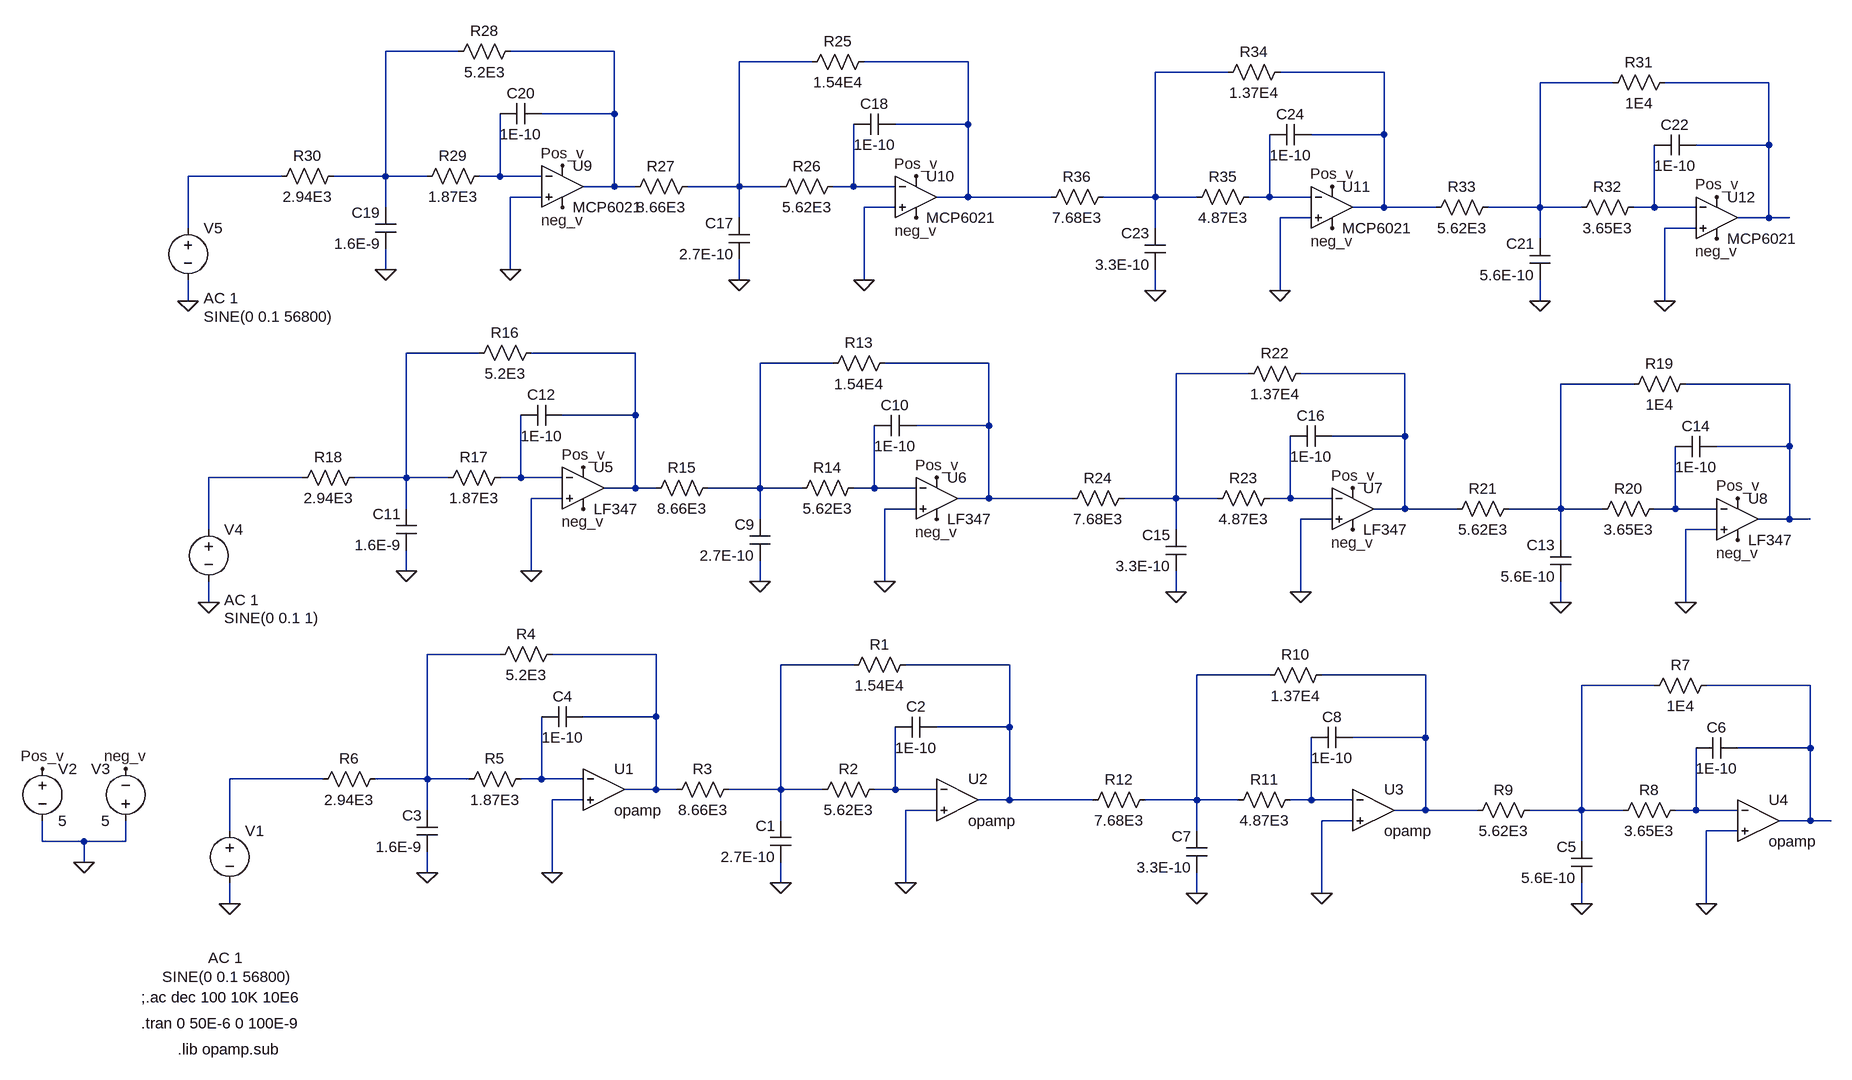
[diagram p0: schematic High order E96 non ideal components.asc]
High order E96 non ideal components.asc, the LTspice schematic file:
Version 4
SHEET 1 2240 680
WIRE 80 -1232 -32 -1232
WIRE 320 -1232 160 -1232
WIRE 624 -1216 512 -1216
WIRE 864 -1216 704 -1216
WIRE 1264 -1200 1152 -1200
WIRE 1504 -1200 1344 -1200
WIRE 1856 -1184 1744 -1184
WIRE 2096 -1184 1936 -1184
WIRE 320 -1136 320 -1232
WIRE 320 -1136 208 -1136
WIRE 864 -1120 864 -1216
WIRE 864 -1120 752 -1120
WIRE 1504 -1104 1504 -1200
WIRE 1504 -1104 1392 -1104
WIRE 2096 -1088 2096 -1184
WIRE 2096 -1088 1984 -1088
WIRE -192 -1040 -336 -1040
WIRE -32 -1040 -32 -1232
WIRE -32 -1040 -112 -1040
WIRE 32 -1040 -32 -1040
WIRE 144 -1040 144 -1136
WIRE 144 -1040 112 -1040
WIRE 208 -1040 144 -1040
WIRE 320 -1024 320 -1136
WIRE 320 -1024 272 -1024
WIRE 352 -1024 320 -1024
WIRE 512 -1024 512 -1216
WIRE 512 -1024 432 -1024
WIRE 576 -1024 512 -1024
WIRE 688 -1024 688 -1120
WIRE 688 -1024 656 -1024
WIRE 752 -1024 688 -1024
WIRE 208 -1008 160 -1008
WIRE 864 -1008 864 -1120
WIRE 864 -1008 816 -1008
WIRE 992 -1008 864 -1008
WIRE 1152 -1008 1152 -1200
WIRE 1152 -1008 1072 -1008
WIRE 1216 -1008 1152 -1008
WIRE 1328 -1008 1328 -1104
WIRE 1328 -1008 1296 -1008
WIRE 1392 -1008 1328 -1008
WIRE -32 -992 -32 -1040
WIRE 752 -992 704 -992
WIRE 1504 -992 1504 -1104
WIRE 1504 -992 1456 -992
WIRE 1584 -992 1504 -992
WIRE 1744 -992 1744 -1184
WIRE 1744 -992 1664 -992
WIRE 1808 -992 1744 -992
WIRE 1920 -992 1920 -1088
WIRE 1920 -992 1888 -992
WIRE 1984 -992 1920 -992
WIRE 512 -976 512 -1024
WIRE 1392 -976 1344 -976
WIRE 2096 -976 2096 -1088
WIRE 2096 -976 2048 -976
WIRE 2128 -976 2096 -976
WIRE -336 -960 -336 -1040
WIRE 1152 -960 1152 -1008
WIRE 1984 -960 1936 -960
WIRE 1744 -944 1744 -992
WIRE -32 -896 -32 -928
WIRE 160 -896 160 -1008
WIRE 512 -880 512 -912
WIRE 704 -880 704 -992
WIRE 1152 -864 1152 -896
WIRE 1344 -864 1344 -976
WIRE -336 -848 -336 -880
WIRE 1744 -848 1744 -880
WIRE 1936 -848 1936 -960
WIRE 112 -768 0 -768
WIRE 352 -768 192 -768
WIRE 656 -752 544 -752
WIRE 896 -752 736 -752
WIRE 1296 -736 1184 -736
WIRE 1536 -736 1376 -736
WIRE 1888 -720 1776 -720
WIRE 2128 -720 1968 -720
WIRE 352 -672 352 -768
WIRE 352 -672 240 -672
WIRE 896 -656 896 -752
WIRE 896 -656 784 -656
WIRE 1536 -640 1536 -736
WIRE 1536 -640 1424 -640
WIRE 2128 -624 2128 -720
WIRE 2128 -624 2016 -624
WIRE -160 -576 -304 -576
WIRE 0 -576 0 -768
WIRE 0 -576 -80 -576
WIRE 64 -576 0 -576
WIRE 176 -576 176 -672
WIRE 176 -576 144 -576
WIRE 240 -576 176 -576
WIRE 352 -560 352 -672
WIRE 352 -560 304 -560
WIRE 384 -560 352 -560
WIRE 544 -560 544 -752
WIRE 544 -560 464 -560
WIRE 608 -560 544 -560
WIRE 720 -560 720 -656
WIRE 720 -560 688 -560
WIRE 784 -560 720 -560
WIRE 240 -544 192 -544
WIRE 896 -544 896 -656
WIRE 896 -544 848 -544
WIRE 1024 -544 896 -544
WIRE 1184 -544 1184 -736
WIRE 1184 -544 1104 -544
WIRE 1248 -544 1184 -544
WIRE 1360 -544 1360 -640
WIRE 1360 -544 1328 -544
WIRE 1424 -544 1360 -544
WIRE 0 -528 0 -576
WIRE 784 -528 736 -528
WIRE 1536 -528 1536 -640
WIRE 1536 -528 1488 -528
WIRE 1616 -528 1536 -528
WIRE 1776 -528 1776 -720
WIRE 1776 -528 1696 -528
WIRE 1840 -528 1776 -528
WIRE 1952 -528 1952 -624
WIRE 1952 -528 1920 -528
WIRE 2016 -528 1952 -528
WIRE 544 -512 544 -560
WIRE 1424 -512 1376 -512
WIRE 2128 -512 2128 -624
WIRE 2128 -512 2080 -512
WIRE 2160 -512 2128 -512
WIRE -304 -496 -304 -576
WIRE 1184 -496 1184 -544
WIRE 2016 -496 1968 -496
WIRE 1776 -480 1776 -528
WIRE 0 -432 0 -464
WIRE 192 -432 192 -544
WIRE 544 -416 544 -448
WIRE 736 -416 736 -528
WIRE 1184 -400 1184 -432
WIRE 1376 -400 1376 -512
WIRE -304 -384 -304 -416
WIRE 1776 -384 1776 -416
WIRE 1968 -384 1968 -496
WIRE 144 -304 32 -304
WIRE 384 -304 224 -304
WIRE 688 -288 576 -288
WIRE 928 -288 768 -288
WIRE 1328 -272 1216 -272
WIRE 1568 -272 1408 -272
WIRE 1920 -256 1808 -256
WIRE 2160 -256 2000 -256
WIRE 384 -208 384 -304
WIRE 384 -208 272 -208
WIRE 928 -192 928 -288
WIRE 928 -192 816 -192
WIRE 1568 -176 1568 -272
WIRE 1568 -176 1456 -176
WIRE 2160 -160 2160 -256
WIRE 2160 -160 2048 -160
WIRE -128 -112 -272 -112
WIRE 32 -112 32 -304
WIRE 32 -112 -48 -112
WIRE 96 -112 32 -112
WIRE 208 -112 208 -208
WIRE 208 -112 176 -112
WIRE 272 -112 208 -112
WIRE 384 -96 384 -208
WIRE 384 -96 336 -96
WIRE 416 -96 384 -96
WIRE 576 -96 576 -288
WIRE 576 -96 496 -96
WIRE 640 -96 576 -96
WIRE 752 -96 752 -192
WIRE 752 -96 720 -96
WIRE 816 -96 752 -96
WIRE 272 -80 224 -80
WIRE 928 -80 928 -192
WIRE 928 -80 880 -80
WIRE 1056 -80 928 -80
WIRE 1216 -80 1216 -272
WIRE 1216 -80 1136 -80
WIRE 1280 -80 1216 -80
WIRE 1392 -80 1392 -176
WIRE 1392 -80 1360 -80
WIRE 1456 -80 1392 -80
WIRE 32 -64 32 -112
WIRE 816 -64 768 -64
WIRE 1568 -64 1568 -176
WIRE 1568 -64 1520 -64
WIRE 1648 -64 1568 -64
WIRE 1808 -64 1808 -256
WIRE 1808 -64 1728 -64
WIRE 1872 -64 1808 -64
WIRE 1984 -64 1984 -160
WIRE 1984 -64 1952 -64
WIRE 2048 -64 1984 -64
WIRE 576 -48 576 -96
WIRE 1456 -48 1408 -48
WIRE 2160 -48 2160 -160
WIRE 2160 -48 2112 -48
WIRE 2192 -48 2160 -48
WIRE -272 -32 -272 -112
WIRE 1216 -32 1216 -80
WIRE 2048 -32 2000 -32
WIRE -560 -16 -560 -48
WIRE -496 -16 -560 -16
WIRE -432 -16 -432 -48
WIRE -432 -16 -496 -16
WIRE 1808 -16 1808 -64
WIRE -496 16 -496 -16
WIRE 32 32 32 0
WIRE 224 32 224 -80
WIRE 576 48 576 16
WIRE 768 48 768 -64
WIRE 1216 64 1216 32
WIRE 1408 64 1408 -48
WIRE -272 80 -272 48
WIRE 1808 80 1808 48
WIRE 2000 80 2000 -32
FLAG 768 48 0
FLAG 576 48 0
FLAG -272 80 0
FLAG -560 -128 Pos_v
FLAG -432 -128 neg_v
FLAG -496 16 0
FLAG 224 32 0
FLAG 32 32 0
FLAG 2000 80 0
FLAG 1808 80 0
FLAG 1408 64 0
FLAG 1216 64 0
FLAG 736 -416 0
FLAG 544 -416 0
FLAG -304 -384 0
FLAG 816 -576 Pos_v
FLAG 816 -512 neg_v
FLAG 192 -432 0
FLAG 0 -432 0
FLAG 272 -592 Pos_v
FLAG 272 -528 neg_v
FLAG 1968 -384 0
FLAG 1776 -384 0
FLAG 2048 -544 Pos_v
FLAG 2048 -480 neg_v
FLAG 1376 -400 0
FLAG 1184 -400 0
FLAG 1456 -560 Pos_v
FLAG 1456 -496 neg_v
FLAG 704 -880 0
FLAG 512 -880 0
FLAG -336 -848 0
FLAG 784 -1040 Pos_v
FLAG 784 -976 neg_v
FLAG 160 -896 0
FLAG -32 -896 0
FLAG 240 -1056 Pos_v
FLAG 240 -992 neg_v
FLAG 1936 -848 0
FLAG 1744 -848 0
FLAG 2016 -1008 Pos_v
FLAG 2016 -944 neg_v
FLAG 1344 -864 0
FLAG 1152 -864 0
FLAG 1424 -1024 Pos_v
FLAG 1424 -960 neg_v
SYMBOL res 784 -304 R90
WINDOW 0 0 56 VBottom 2
WINDOW 3 32 56 VTop 2
SYMATTR InstName R1
SYMATTR Value 1.54E4
SYMBOL res 736 -112 R90
WINDOW 0 0 56 VBottom 2
WINDOW 3 32 56 VTop 2
SYMATTR InstName R2
SYMATTR Value 5.62E3
SYMBOL res 512 -112 R90
WINDOW 0 0 56 VBottom 2
WINDOW 3 32 56 VTop 2
SYMATTR InstName R3
SYMATTR Value 8.66E3
SYMBOL cap 592 16 R180
WINDOW 0 24 56 Left 2
WINDOW 3 24 8 Left 2
SYMATTR InstName C1
SYMATTR Value 2.7E-10
SYMBOL cap 752 -176 R270
WINDOW 0 32 32 VTop 2
WINDOW 3 0 32 VBottom 2
SYMATTR InstName C2
SYMATTR Value 1E-10
SYMBOL voltage -272 -48 R0
WINDOW 123 -33 211 Left 2
WINDOW 39 0 0 Left 0
WINDOW 3 -104 240 Left 2
SYMATTR Value2 AC 1
SYMATTR Value SINE(0 0.1 56800)
SYMATTR InstName V1
SYMBOL voltage -560 -144 R0
WINDOW 123 0 0 Left 0
WINDOW 39 0 0 Left 0
SYMATTR InstName V2
SYMATTR Value 5
SYMBOL voltage -432 -32 R180
WINDOW 0 24 96 Left 2
WINDOW 3 24 16 Left 2
SYMATTR InstName V3
SYMATTR Value 5
SYMBOL res 240 -320 R90
WINDOW 0 0 56 VBottom 2
WINDOW 3 32 56 VTop 2
SYMATTR InstName R4
SYMATTR Value 5.2E3
SYMBOL res 192 -128 R90
WINDOW 0 0 56 VBottom 2
WINDOW 3 32 56 VTop 2
SYMATTR InstName R5
SYMATTR Value 1.87E3
SYMBOL res -32 -128 R90
WINDOW 0 0 56 VBottom 2
WINDOW 3 32 56 VTop 2
SYMATTR InstName R6
SYMATTR Value 2.94E3
SYMBOL cap 48 0 R180
WINDOW 0 24 56 Left 2
WINDOW 3 24 8 Left 2
SYMATTR InstName C3
SYMATTR Value 1.6E-9
SYMBOL cap 208 -192 R270
WINDOW 0 32 32 VTop 2
WINDOW 3 0 32 VBottom 2
SYMATTR InstName C4
SYMATTR Value 1E-10
SYMBOL res 2016 -272 R90
WINDOW 0 0 56 VBottom 2
WINDOW 3 32 56 VTop 2
SYMATTR InstName R7
SYMATTR Value 1E4
SYMBOL res 1968 -80 R90
WINDOW 0 0 56 VBottom 2
WINDOW 3 32 56 VTop 2
SYMATTR InstName R8
SYMATTR Value 3.65E3
SYMBOL res 1744 -80 R90
WINDOW 0 0 56 VBottom 2
WINDOW 3 32 56 VTop 2
SYMATTR InstName R9
SYMATTR Value 5.62E3
SYMBOL cap 1824 48 R180
WINDOW 0 24 56 Left 2
WINDOW 3 24 8 Left 2
SYMATTR InstName C5
SYMATTR Value 5.6E-10
SYMBOL cap 1984 -144 R270
WINDOW 0 32 32 VTop 2
WINDOW 3 0 32 VBottom 2
SYMATTR InstName C6
SYMATTR Value 1E-10
SYMBOL res 1424 -288 R90
WINDOW 0 0 56 VBottom 2
WINDOW 3 32 56 VTop 2
SYMATTR InstName R10
SYMATTR Value 1.37E4
SYMBOL res 1376 -96 R90
WINDOW 0 0 56 VBottom 2
WINDOW 3 32 56 VTop 2
SYMATTR InstName R11
SYMATTR Value 4.87E3
SYMBOL res 1152 -96 R90
WINDOW 0 0 56 VBottom 2
WINDOW 3 32 56 VTop 2
SYMATTR InstName R12
SYMATTR Value 7.68E3
SYMBOL cap 1232 32 R180
WINDOW 0 24 56 Left 2
WINDOW 3 24 8 Left 2
SYMATTR InstName C7
SYMATTR Value 3.3E-10
SYMBOL cap 1392 -160 R270
WINDOW 0 32 32 VTop 2
WINDOW 3 0 32 VBottom 2
SYMATTR InstName C8
SYMATTR Value 1E-10
SYMBOL res 752 -768 R90
WINDOW 0 0 56 VBottom 2
WINDOW 3 32 56 VTop 2
SYMATTR InstName R13
SYMATTR Value 1.54E4
SYMBOL res 704 -576 R90
WINDOW 0 0 56 VBottom 2
WINDOW 3 32 56 VTop 2
SYMATTR InstName R14
SYMATTR Value 5.62E3
SYMBOL res 480 -576 R90
WINDOW 0 0 56 VBottom 2
WINDOW 3 32 56 VTop 2
SYMATTR InstName R15
SYMATTR Value 8.66E3
SYMBOL cap 560 -448 R180
WINDOW 0 24 56 Left 2
WINDOW 3 24 8 Left 2
SYMATTR InstName C9
SYMATTR Value 2.7E-10
SYMBOL cap 720 -640 R270
WINDOW 0 32 32 VTop 2
WINDOW 3 0 32 VBottom 2
SYMATTR InstName C10
SYMATTR Value 1E-10
SYMBOL voltage -304 -512 R0
WINDOW 123 24 124 Left 2
WINDOW 39 0 0 Left 0
WINDOW 3 24 152 Left 2
SYMATTR Value2 AC 1
SYMATTR Value SINE(0 0.1 1)
SYMATTR InstName V4
SYMBOL res 208 -784 R90
WINDOW 0 0 56 VBottom 2
WINDOW 3 32 56 VTop 2
SYMATTR InstName R16
SYMATTR Value 5.2E3
SYMBOL res 160 -592 R90
WINDOW 0 0 56 VBottom 2
WINDOW 3 32 56 VTop 2
SYMATTR InstName R17
SYMATTR Value 1.87E3
SYMBOL res -64 -592 R90
WINDOW 0 0 56 VBottom 2
WINDOW 3 32 56 VTop 2
SYMATTR InstName R18
SYMATTR Value 2.94E3
SYMBOL cap 16 -464 R180
WINDOW 0 24 56 Left 2
WINDOW 3 24 8 Left 2
SYMATTR InstName C11
SYMATTR Value 1.6E-9
SYMBOL cap 176 -656 R270
WINDOW 0 32 32 VTop 2
WINDOW 3 0 32 VBottom 2
SYMATTR InstName C12
SYMATTR Value 1E-10
SYMBOL res 1984 -736 R90
WINDOW 0 0 56 VBottom 2
WINDOW 3 32 56 VTop 2
SYMATTR InstName R19
SYMATTR Value 1E4
SYMBOL res 1936 -544 R90
WINDOW 0 0 56 VBottom 2
WINDOW 3 32 56 VTop 2
SYMATTR InstName R20
SYMATTR Value 3.65E3
SYMBOL res 1712 -544 R90
WINDOW 0 0 56 VBottom 2
WINDOW 3 32 56 VTop 2
SYMATTR InstName R21
SYMATTR Value 5.62E3
SYMBOL cap 1792 -416 R180
WINDOW 0 24 56 Left 2
WINDOW 3 24 8 Left 2
SYMATTR InstName C13
SYMATTR Value 5.6E-10
SYMBOL cap 1952 -608 R270
WINDOW 0 32 32 VTop 2
WINDOW 3 0 32 VBottom 2
SYMATTR InstName C14
SYMATTR Value 1E-10
SYMBOL res 1392 -752 R90
WINDOW 0 0 56 VBottom 2
WINDOW 3 32 56 VTop 2
SYMATTR InstName R22
SYMATTR Value 1.37E4
SYMBOL res 1344 -560 R90
WINDOW 0 0 56 VBottom 2
WINDOW 3 32 56 VTop 2
SYMATTR InstName R23
SYMATTR Value 4.87E3
SYMBOL res 1120 -560 R90
WINDOW 0 0 56 VBottom 2
WINDOW 3 32 56 VTop 2
SYMATTR InstName R24
SYMATTR Value 7.68E3
SYMBOL cap 1200 -432 R180
WINDOW 0 24 56 Left 2
WINDOW 3 24 8 Left 2
SYMATTR InstName C15
SYMATTR Value 3.3E-10
SYMBOL cap 1360 -624 R270
WINDOW 0 32 32 VTop 2
WINDOW 3 0 32 VBottom 2
SYMATTR InstName C16
SYMATTR Value 1E-10
SYMBOL AutoGenerated\\LF347 272 -560 R0
SYMATTR InstName U5
SYMBOL AutoGenerated\\LF347 816 -544 R0
SYMATTR InstName U6
SYMBOL AutoGenerated\\LF347 1456 -528 R0
SYMATTR InstName U7
SYMBOL AutoGenerated\\LF347 2048 -512 R0
SYMATTR InstName U8
SYMBOL Opamps\\opamp 304 -160 R0
SYMATTR InstName U1
SYMBOL Opamps\\opamp 848 -144 R0
SYMATTR InstName U2
SYMBOL Opamps\\opamp 1488 -128 R0
SYMATTR InstName U3
SYMBOL Opamps\\opamp 2080 -112 R0
SYMATTR InstName U4
SYMBOL res 720 -1232 R90
WINDOW 0 0 56 VBottom 2
WINDOW 3 32 56 VTop 2
SYMATTR InstName R25
SYMATTR Value 1.54E4
SYMBOL res 672 -1040 R90
WINDOW 0 0 56 VBottom 2
WINDOW 3 32 56 VTop 2
SYMATTR InstName R26
SYMATTR Value 5.62E3
SYMBOL res 448 -1040 R90
WINDOW 0 0 56 VBottom 2
WINDOW 3 32 56 VTop 2
SYMATTR InstName R27
SYMATTR Value 8.66E3
SYMBOL cap 528 -912 R180
WINDOW 0 24 56 Left 2
WINDOW 3 24 8 Left 2
SYMATTR InstName C17
SYMATTR Value 2.7E-10
SYMBOL cap 688 -1104 R270
WINDOW 0 32 32 VTop 2
WINDOW 3 0 32 VBottom 2
SYMATTR InstName C18
SYMATTR Value 1E-10
SYMBOL voltage -336 -976 R0
WINDOW 123 24 124 Left 2
WINDOW 39 0 0 Left 0
WINDOW 3 24 152 Left 2
SYMATTR Value2 AC 1
SYMATTR Value SINE(0 0.1 56800)
SYMATTR InstName V5
SYMBOL res 176 -1248 R90
WINDOW 0 0 56 VBottom 2
WINDOW 3 32 56 VTop 2
SYMATTR InstName R28
SYMATTR Value 5.2E3
SYMBOL res 128 -1056 R90
WINDOW 0 0 56 VBottom 2
WINDOW 3 32 56 VTop 2
SYMATTR InstName R29
SYMATTR Value 1.87E3
SYMBOL res -96 -1056 R90
WINDOW 0 0 56 VBottom 2
WINDOW 3 32 56 VTop 2
SYMATTR InstName R30
SYMATTR Value 2.94E3
SYMBOL cap -16 -928 R180
WINDOW 0 24 56 Left 2
WINDOW 3 24 8 Left 2
SYMATTR InstName C19
SYMATTR Value 1.6E-9
SYMBOL cap 144 -1120 R270
WINDOW 0 32 32 VTop 2
WINDOW 3 0 32 VBottom 2
SYMATTR InstName C20
SYMATTR Value 1E-10
SYMBOL res 1952 -1200 R90
WINDOW 0 0 56 VBottom 2
WINDOW 3 32 56 VTop 2
SYMATTR InstName R31
SYMATTR Value 1E4
SYMBOL res 1904 -1008 R90
WINDOW 0 0 56 VBottom 2
WINDOW 3 32 56 VTop 2
SYMATTR InstName R32
SYMATTR Value 3.65E3
SYMBOL res 1680 -1008 R90
WINDOW 0 0 56 VBottom 2
WINDOW 3 32 56 VTop 2
SYMATTR InstName R33
SYMATTR Value 5.62E3
SYMBOL cap 1760 -880 R180
WINDOW 0 24 56 Left 2
WINDOW 3 24 8 Left 2
SYMATTR InstName C21
SYMATTR Value 5.6E-10
SYMBOL cap 1920 -1072 R270
WINDOW 0 32 32 VTop 2
WINDOW 3 0 32 VBottom 2
SYMATTR InstName C22
SYMATTR Value 1E-10
SYMBOL res 1360 -1216 R90
WINDOW 0 0 56 VBottom 2
WINDOW 3 32 56 VTop 2
SYMATTR InstName R34
SYMATTR Value 1.37E4
SYMBOL res 1312 -1024 R90
WINDOW 0 0 56 VBottom 2
WINDOW 3 32 56 VTop 2
SYMATTR InstName R35
SYMATTR Value 4.87E3
SYMBOL res 1088 -1024 R90
WINDOW 0 0 56 VBottom 2
WINDOW 3 32 56 VTop 2
SYMATTR InstName R36
SYMATTR Value 7.68E3
SYMBOL cap 1168 -896 R180
WINDOW 0 24 56 Left 2
WINDOW 3 24 8 Left 2
SYMATTR InstName C23
SYMATTR Value 3.3E-10
SYMBOL cap 1328 -1088 R270
WINDOW 0 32 32 VTop 2
WINDOW 3 0 32 VBottom 2
SYMATTR InstName C24
SYMATTR Value 1E-10
SYMBOL AutoGenerated\\MCP6021 240 -1024 R0
SYMATTR InstName U9
SYMBOL AutoGenerated\\MCP6021 784 -1008 R0
SYMATTR InstName U10
SYMBOL AutoGenerated\\MCP6021 1424 -992 R0
SYMATTR InstName U11
SYMBOL AutoGenerated\\MCP6021 2016 -976 R0
SYMATTR InstName U12
TEXT -408 224 Left 2 !;.ac dec 100 10K 10E6
TEXT -408 264 Left 2 !.tran 0 50E-6 0 100E-9
TEXT -352 304 Left 2 !.lib opamp.sub

The netlist it stands for:
* High order E96 non ideal components.asc
R1 N030 N029 1.54E4
R2 N037 N029 5.62E3
R3 N029 N028 8.66E3
C1 0 N029 2.7E-10
C2 N037 N030 1E-10
V1 N035 0 SINE(0 0.1 56800) AC 1
V2 Pos_v 0 5
V3 0 neg_v 5
R4 N028 N027 5.2E3
R5 N036 N027 1.87E3
R6 N027 N035 2.94E3
C3 0 N027 1.6E-9
C4 N036 N028 1E-10
R7 N034 N033 1E4
R8 N039 N033 3.65E3
R9 N033 N032 5.62E3
C5 0 N033 5.6E-10
C6 N039 N034 1E-10
R10 N032 N031 1.37E4
R11 N038 N031 4.87E3
R12 N031 N030 7.68E3
C7 0 N031 3.3E-10
C8 N038 N032 1E-10
R13 N017 N016 1.54E4
R14 N024 N016 5.62E3
R15 N016 N015 8.66E3
C9 0 N016 2.7E-10
C10 N024 N017 1E-10
V4 N022 0 SINE(0 0.1 1) AC 1
R16 N015 N014 5.2E3
R17 N023 N014 1.87E3
R18 N014 N022 2.94E3
C11 0 N014 1.6E-9
C12 N023 N015 1E-10
R19 N021 N020 1E4
R20 N026 N020 3.65E3
R21 N020 N019 5.62E3
C13 0 N020 5.6E-10
C14 N026 N021 1E-10
R22 N019 N018 1.37E4
R23 N025 N018 4.87E3
R24 N018 N017 7.68E3
C15 0 N018 3.3E-10
C16 N025 N019 1E-10
* U5: LF347 (symbol AutoGenerated\LF347 not available, pins judged from their places): In+=0 In-=N023 V+=Pos_v V-=neg_v OUT=N015
* U6: LF347 (symbol AutoGenerated\LF347 not available, pins judged from their places): In+=0 In-=N024 V+=Pos_v V-=neg_v OUT=N017
* U7: LF347 (symbol AutoGenerated\LF347 not available, pins judged from their places): In+=0 In-=N025 V+=Pos_v V-=neg_v OUT=N019
* U8: LF347 (symbol AutoGenerated\LF347 not available, pins judged from their places): In+=0 In-=N026 V+=Pos_v V-=neg_v OUT=N021
XU1 N036 0 N028 opamp Aol=100K GBW=10Meg  ; pins invin noninvin out
XU2 N037 0 N030 opamp Aol=100K GBW=10Meg  ; pins invin noninvin out
XU3 N038 0 N032 opamp Aol=100K GBW=10Meg  ; pins invin noninvin out
XU4 N039 0 N034 opamp Aol=100K GBW=10Meg  ; pins invin noninvin out
R25 N004 N003 1.54E4
R26 N011 N003 5.62E3
R27 N003 N002 8.66E3
C17 0 N003 2.7E-10
C18 N011 N004 1E-10
V5 N009 0 SINE(0 0.1 56800) AC 1
R28 N002 N001 5.2E3
R29 N010 N001 1.87E3
R30 N001 N009 2.94E3
C19 0 N001 1.6E-9
C20 N010 N002 1E-10
R31 N008 N007 1E4
R32 N013 N007 3.65E3
R33 N007 N006 5.62E3
C21 0 N007 5.6E-10
C22 N013 N008 1E-10
R34 N006 N005 1.37E4
R35 N012 N005 4.87E3
R36 N005 N004 7.68E3
C23 0 N005 3.3E-10
C24 N012 N006 1E-10
* U9: MCP6021 (symbol AutoGenerated\MCP6021 not available, pins judged from their places): In+=0 In-=N010 V+=Pos_v V-=neg_v OUT=N002
* U10: MCP6021 (symbol AutoGenerated\MCP6021 not available, pins judged from their places): In+=0 In-=N011 V+=Pos_v V-=neg_v OUT=N004
* U11: MCP6021 (symbol AutoGenerated\MCP6021 not available, pins judged from their places): In+=0 In-=N012 V+=Pos_v V-=neg_v OUT=N006
* U12: MCP6021 (symbol AutoGenerated\MCP6021 not available, pins judged from their places): In+=0 In-=N013 V+=Pos_v V-=neg_v OUT=N008
;.ac dec 100 10K 10E6
.tran 0 50E-6 0 100E-9
.lib opamp.sub
.backanno
.end